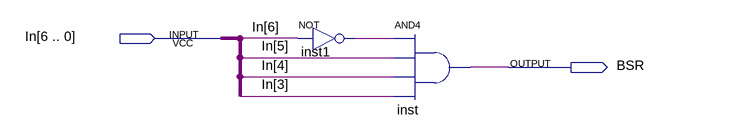
[diagram p0: schematic sheet]
// Quartus schematic ON_4_BSR.bdf as structural Verilog: 2 symbols, 2 pins
module ON_4_BSR (
  input  [6:0] In,
  output BSR
);

  wire inst1_out;

  not inst1 (inst1_out, In[6]);
  and inst (BSR, inst1_out, In[5], In[4], In[3]);
endmodule
